# Altium schematic sheet lte-router_V2.SchDoc
size A2
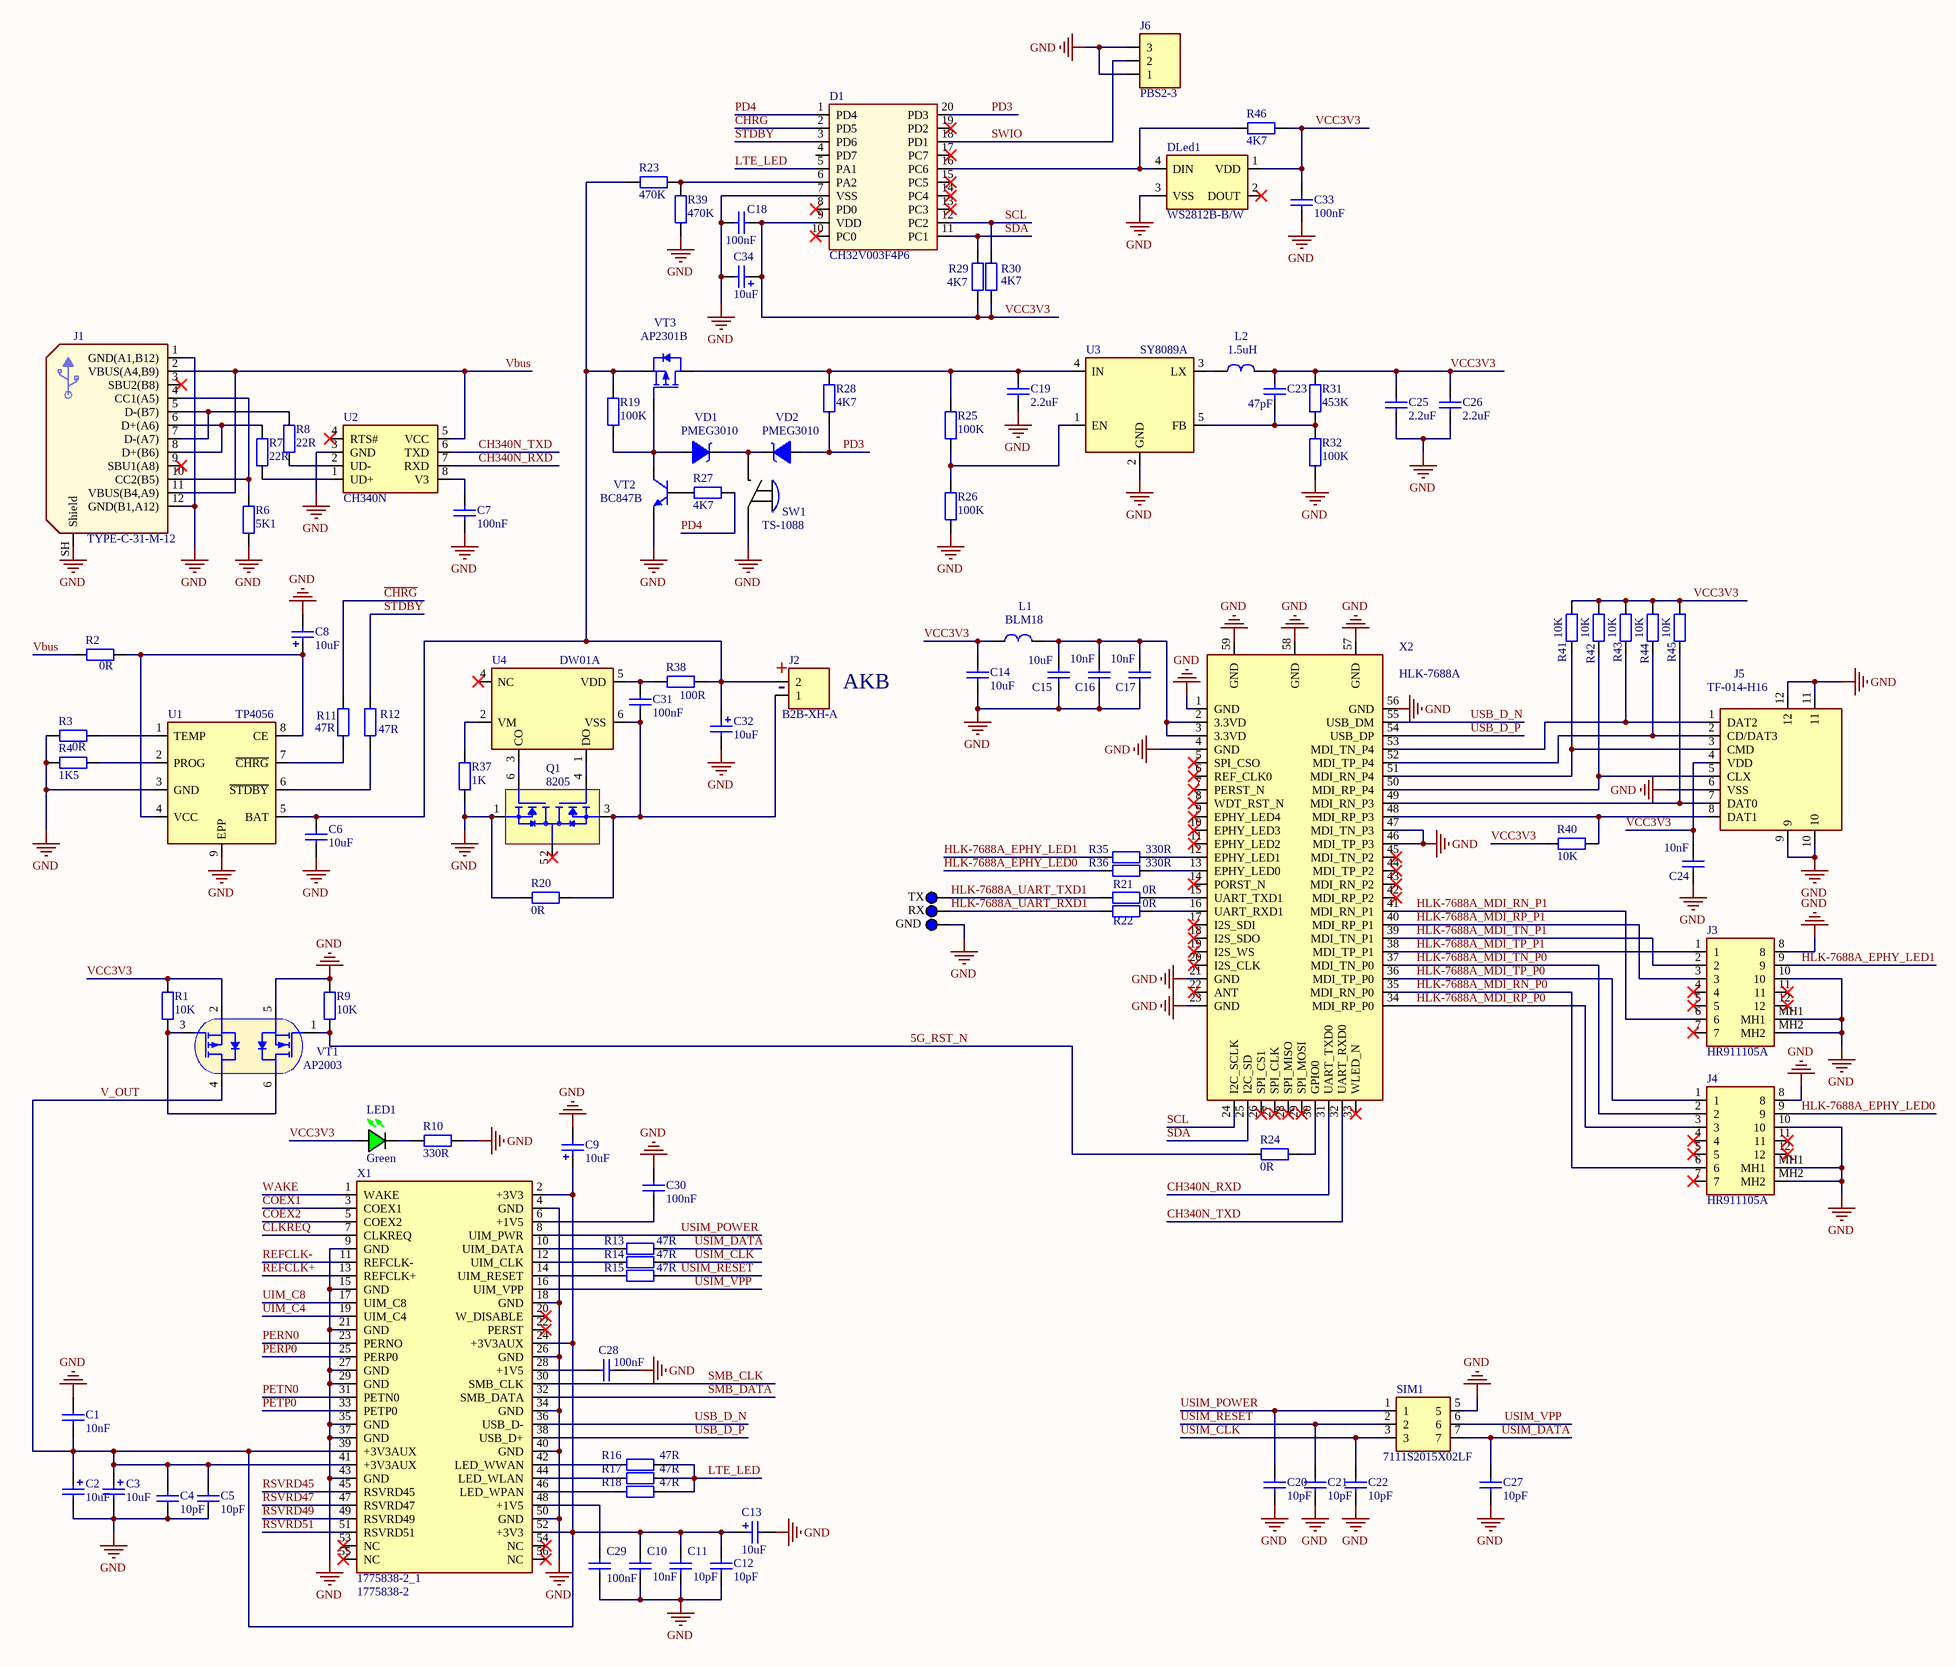
[diagram p0: lte-router_V2.SchDoc]

## Parts
C1  value 10nF  [C_0402]  (hidden comment: Cap1)
C2  value 10uF  [TANT_CAP_A]  (hidden comment: CapPOL1)
C3  value 10uF  [TANT_CAP_A]  (hidden comment: CapPOL1)
C4  value 10pF  [C_0402]  (hidden comment: Cap1)
C5  value 10pF  [C_0402]  (hidden comment: Cap1)
C6  value 10uF  [C_0805]  (hidden comment: Cap1)
C7  value 100nF  [C_0402]  (hidden comment: Cap1)
C8  value 10uF  [TANT_CAP_A]  (hidden comment: CapPOL1)
C9  value 10uF  [TANT_CAP_A]  (hidden comment: CapPOL1)
C10  value 10nF  [C_0402]  (hidden comment: Cap1)
C11  value 10pF  [C_0402]  (hidden comment: Cap1)
C12  value 10pF  [C_0402]  (hidden comment: Cap1)
C13  value 10uF  [TANT_CAP_A]  (hidden comment: CapPOL1)
C14  value 10uF  [C_0402]  (hidden comment: Cap1)
C15  value 10uF  [C_0402]  (hidden comment: Cap1)
C16  value 10nF  [C_0402]  (hidden comment: Cap1)
C17  value 10nF  [C_0402]  (hidden comment: Cap1)
C18  value 100nF  [C_0402]  (hidden comment: Cap1)
C19  value 2.2uF  [C_0603]  (hidden comment: Cap1)
C20  value 10pF  [C_0402]  (hidden comment: Cap1)
C21  value 10pF  [C_0402]  (hidden comment: Cap1)
C22  value 10pF  [C_0402]  (hidden comment: Cap1)
C23  value 47pF  [C_0402]  (hidden comment: Cap1)
C24  value 10nF  [C_0402]  (hidden comment: Cap1)
C25  value 2.2uF  [C_0603]  (hidden comment: Cap1)
C26  value 2.2uF  [C_0603]  (hidden comment: Cap1)
C27  value 10pF  [C_0402]  (hidden comment: Cap1)
C28  value 100nF  [C_0402]  (hidden comment: Cap1)
C29  value 100nF  [C_0402]  (hidden comment: Cap1)
C30  value 100nF  [C_0402]  (hidden comment: Cap1)
C31  value 100nF  [C_0402]  (hidden comment: Cap1)
C32  value 10uF  [TANT_CAP_A]  (hidden comment: CapPOL1)
C33  value 100nF  [C_0402]  (hidden comment: Cap1)
C34  value 10uF  [TANT_CAP_A]  (hidden comment: CapPOL1)
D1  value CH32V003F4P6  [TSSOP20]  (hidden comment: CH32V003F4P6_1)
DLed1  value WS2812B-B/W  [SMD5050]  (hidden comment: D_RGB_LED1)
GND  GND  [KP_c2_h1]  (value not drawn)
J1  value TYPE-C-31-M-12  [USB-31CW04-01(R)N]  (hidden comment: USB-TYPE-C-12pin_1)
J2  value B2B-XH-A  [B2B-XH-A]  (hidden comment: Conn2)
J3  value HR911105A  [HR911105A]  (hidden comment: HR911105A_1)
J4  value HR911105A  [HR911105A]  (hidden comment: HR911105A_1)
J5  value TF-014-H16  [TF-014-H16]  (hidden comment: SD-CARD-12pin_1)
J6  value PBS2-3  [PBS2-3]  (hidden comment: Conn3)
L1  value BLM18  [L_0603]  (hidden comment: Inductor1)
L2  value 1.5uH  [SMD4x4]  (hidden comment: Inductor1)
LED1  value Green  [LED_0402_G]  (hidden comment: LED_G1)
Q1  value 8205  [SOT-23-6]  (hidden comment: FS8205A_1)
R1  value 10K  [R_0402]  (hidden comment: Res1)
R2  value 0R  [R_0402]  (hidden comment: Res1)
R3  value 0R  [R_0402]  (hidden comment: Res1)
R4  value 1K5  [R_0402]  (hidden comment: Res1)
R6  value 5K1  [R_0402]  (hidden comment: Res1)
R7  value 22R  [R_0402]  (hidden comment: Res1)
R8  value 22R  [R_0402]  (hidden comment: Res1)
R9  value 10K  [R_0402]  (hidden comment: Res1)
R10  value 330R  [R_0402]  (hidden comment: Res1)
R11  value 47R  [R_0402]  (hidden comment: Res1)
R12  value 47R  [R_0402]  (hidden comment: Res1)
R13  value 47R  [R_0402]  (hidden comment: Res1)
R14  value 47R  [R_0402]  (hidden comment: Res1)
R15  value 47R  [R_0402]  (hidden comment: Res1)
R16  value 47R  [R_0402]  (hidden comment: Res1)
R17  value 47R  [R_0402]  (hidden comment: Res1)
R18  value 47R  [R_0402]  (hidden comment: Res1)
R19  value 100K  [R_0402]  (hidden comment: Res1)
R20  value 0R  [R_0603]  (hidden comment: Res1)
R21  value 0R  [R_0402]  (hidden comment: Res1)
R22  value 0R  [R_0402]  (hidden comment: Res1)
R23  value 470K  [R_0402]  (hidden comment: Res1)
R24  value 0R  [R_0402]  (hidden comment: Res1)
R25  value 100K  [R_0402]  (hidden comment: Res1)
R26  value 100K  [R_0402]  (hidden comment: Res1)
R27  value 4K7  [R_0402]  (hidden comment: Res1)
R28  value 4K7  [R_0402]  (hidden comment: Res1)
R29  value 4K7  [R_0402]  (hidden comment: Res1)
R30  value 4K7  [R_0402]  (hidden comment: Res1)
R31  value 453K  [R_0402]  (hidden comment: Res1)
R32  value 100K  [R_0402]  (hidden comment: Res1)
R35  value 330R  [R_0402]  (hidden comment: Res1)
R36  value 330R  [R_0402]  (hidden comment: Res1)
R37  value 1K  [R_0402]  (hidden comment: Res1)
R38  value 100R  [R_0402]  (hidden comment: Res1)
R39  value 470K  [R_0402]  (hidden comment: Res1)
R40  value 10K  [R_0402]  (hidden comment: Res1)
R41  value 10K  [R_0402]  (hidden comment: Res1)
R42  value 10K  [R_0402]  (hidden comment: Res1)
R43  value 10K  [R_0402]  (hidden comment: Res1)
R44  value 10K  [R_0402]  (hidden comment: Res1)
R45  value 10K  [R_0402]  (hidden comment: Res1)
R46  value 4K7  [R_0402]  (hidden comment: Res1)
RX  RX  [KP_c2_h1]  (value not drawn)
SIM1  7111S2015X02LF  [7111S2015X02LF]
SW1  value TS-1088  [TS1088AR02016]  (hidden comment: SW1)
TX  TX  [KP_c2_h1]  (value not drawn)
U1  value TP4056  [ESOP-8]  (hidden comment: TP4056_1)
U2  value CH340N  [SOP-8]  (hidden comment: CH340N_1)
U3  value SY8089A  [SOT-23-5]  (hidden comment: SY8089_1)
U4  value DW01A  [SOT-23-6]  (hidden comment: DW01A_2)
VD1  value PMEG3010  [SOD123]  (hidden comment: D_Shottky1)
VD2  value PMEG3010  [SOD123]  (hidden comment: D_Shottky1)
VT1  value AP2003  [SOT-23-6L]  (hidden comment: P-CH_N-CH)
VT2  value BC847B  [SOT-23-3]  (hidden comment: NPN1)
VT3  value AP2301B  [SOT-23-3]  (hidden comment: P-CH_1)
X1  1775838-2_1  value 1775838-2  [17758382]
X2  value HLK-7688A  [7688A]  (hidden comment: HLK-7688A_1)

## Nets
GND: C1.2 C2.2 C3.2 C4.1 C5.1 C6.2 C7.2 C8.2 C9.2 C10.1 C11.1 C12.1 C13.2 C14.1 C15.1 C16.1 C17.1 C18.2 C19.1 C20.1 C21.1 C22.1 C24.1 C25.1 C26.1 C27.1 C28.1 C29.2 C30.2 C32.2 C33.1 C34.2 D1.7(VSS) DLed1.3(VSS) GND.1 J1.1(GND(A1,B12)) J1.12(GND(B1,A12)) J1.SH(Shield) J3.8 J3.10 J3.MH1 J3.MH2 J4.8 J4.10 J4.MH1 J4.MH2 J5.6(VSS) J5.9 J5.10 J5.11 J5.12 J6.1 J6.3 Q1.1(S1) R3.1 R4.1 R6.1 R9.2 R10.2 R20.1 R26.1 R32.1 R37.1 R39.1 SIM1.5 SW1.1 U1.3(GND) U1.9(EPP) U2.3(GND) U3.2(GND) VT1.5(S1) VT2.2(E) X1.4(GND) X1.9(GND) X1.15(GND) X1.18(GND) X1.21(GND) X1.26(GND) X1.27(GND) X1.29(GND) X1.34(GND) X1.35(GND) X1.37(GND) X1.40(GND) X1.43(GND) X1.50(GND) X2.1(GND) X2.4(GND) X2.21(GND) X2.23(GND) X2.46(MDI_TP_P3) X2.47(MDI_TN_P3) X2.56(GND) X2.57(GND) X2.58(GND) X2.59(GND)
5G_RST_N: R9.1 R24.1 VT1.1(G1)
~{CHRG}: D1.2(PD5) R11.2
~{CLKREQ}: X1.7(CLKREQ)
CH340N_RXD: U2.7(RXD) X2.31(UART_TXD0)
CH340N_TXD: U2.6(TXD) X2.32(UART_RXD0)
COEX1: X1.3(COEX1)
COEX2: X1.5(COEX2)
HLK-7688A_EPHY_LED0: J4.9 R36.1
HLK-7688A_EPHY_LED1: J3.9 R35.1
HLK-7688A_MDI_RN_P0: J4.6 X2.35(MDI_RN_P0)
HLK-7688A_MDI_RN_P1: J3.6 X2.41(MDI_RN_P1)
HLK-7688A_MDI_RP_P0: J4.3 X2.34(MDI_RP_P0)
HLK-7688A_MDI_RP_P1: J3.3 X2.40(MDI_RP_P1)
HLK-7688A_MDI_TN_P0: J4.2 X2.37(MDI_TN_P0)
HLK-7688A_MDI_TN_P1: J3.2 X2.39(MDI_TN_P1)
HLK-7688A_MDI_TP_P0: J4.1 X2.36(MDI_TP_P0)
HLK-7688A_MDI_TP_P1: J3.1 X2.38(MDI_TP_P1)
HLK-7688A_UART_RXD1: R22.1 RX.1
HLK-7688A_UART_TXD1: R21.1 TX.1
LTE_LED: D1.5(PA1) R16.2 R17.2 R18.2
PD3: D1.20(PD3) R28.1 VD2.2
PD4: D1.1(PD4) R27.2
PERN0: X1.23(PERNO)
PERP0: X1.25(PERP0)
PETN0: X1.31(PETN0)
PETP0: X1.33(PETP0)
REFCLK+: X1.13(REFCLK+)
REFCLK-: X1.11(REFCLK-)
RSVRD45: X1.45(RSVRD45)
RSVRD47: X1.47(RSVRD47)
RSVRD49: X1.49(RSVRD49)
RSVRD51: X1.51(RSVRD51)
~{STDBY}: D1.3(PD6) R12.2
SCL: D1.12(PC2) R30.2 X2.24(I2C_SCLK)
SDA: D1.11(PC1) R29.2 X2.25(I2C_SD)
SMB_CLK: X1.30(SMB_CLK)
SMB_DATA: X1.32(SMB_DATA)
SWIO: D1.18(PD1) J6.2
UIM_C4: X1.19(UIM_C4)
UIM_C8: X1.17(UIM_C8)
USB_D_N: X1.36(USB_D-) X2.55(USB_DM)
USB_D_P: X1.38(USB_D+) X2.54(USB_DP)
USIM_CLK: C22.2 R14.2 SIM1.3
USIM_DATA: C27.2 R13.2 SIM1.7
USIM_POWER: C20.2 SIM1.1 X1.8(UIM_PWR)
USIM_RESET: C21.2 R15.2 SIM1.2
USIM_VPP: SIM1.6 X1.16(UIM_VPP)
V_OUT: C1.1 C2.1 C3.1 C4.2 C5.2 C9.1 C10.2 C11.2 C12.2 C13.1 VT1.4(D2) X1.2(+3V3) X1.24(+3V3AUX) X1.39(+3V3AUX) X1.41(+3V3AUX) X1.52(+3V3)
Vbus: J1.2(VBUS(A4,B9)) J1.11(VBUS(B4,A9)) R2.1 U2.5(VCC)
VCC3V3: C14.2 C18.1 C23.2 C24.2 C25.2 C26.2 C33.2 C34.1 D1.9(VDD) DLed1.1(VDD) J5.4(VDD) L1.1 L2.2 LED1.2(A) R1.2 R29.1 R30.1 R31.2 R40.2 R41.2 R42.2 R43.2 R44.2 R45.2 R46.2 VT1.2(S2)
WAKE: X1.1(WAKE)
NetC6_1: C6.1 C32.1 J2.2 R19.2 R23.2 R38.2 U1.5(BAT) VT3.2(S)
NetC7_1: C7.1 U2.8(V3)
NetC8_1: C8.1 R2.2 U1.4(VCC) U1.8(CE)
NetC15_2: C15.2 C16.2 C17.2 L1.2 X2.2(3.3VD) X2.3(3.3VD)
NetC19_2: C19.2 R25.2 R28.2 U3.4(IN) VT3.3(D)
NetC23_1: C23.1 R31.1 R32.2 U3.5(FB)
NetC28_2: C28.2 X1.28(+1V5)
NetC29_1: C29.1 X1.48(+1V5)
NetC30_1: C30.1 X1.6(+1V5)
NetC31_1: C31.1 J2.1 Q1.3(S2) R20.2 U4.6(VSS)
NetC31_2: C31.2 R38.1 U4.5(VDD)
NetD1_6: D1.6(PA2) R23.1 R39.2
NetD1_16: D1.16(PC6) DLed1.4(DIN) R46.1
NetJ1_4: J1.4(CC1(A5)) J1.10(CC2(B5)) R6.2
NetJ1_5: J1.5(D-(B7)) J1.7(D-(A7)) R8.2
NetJ1_6: J1.6(D+(A6)) J1.8(D+(B6)) R7.2
NetJ5_1: J5.1(DAT2) R43.1 X2.53(MDI_TN_P4)
NetJ5_2: J5.2(CD/DAT3) R44.1 X2.52(MDI_TP_P4)
NetJ5_3: J5.3(CMD) R41.1 X2.51(MDI_RN_P4)
NetJ5_5: J5.5(CLX) R42.1 X2.50(MDI_RP_P4)
NetJ5_7: J5.7(DAT0) R45.1 X2.49(MDI_RN_P3)
NetJ5_8: J5.8(DAT1) R40.1 X2.48(MDI_RP_P3)
NetL2_1: L2.1 U3.3(LX)
NetLED1_1: LED1.1(K) R10.1
NetQ1_2: Q1.2(D1) Q1.5(D2)
NetQ1_4: Q1.4(G2) U4.1(DO)
NetQ1_6: Q1.6(G1) U4.3(CO)
NetR1_1: R1.1 VT1.3(G2) VT1.6(D1)
NetR3_2: R3.2 U1.1(TEMP)
NetR4_2: R4.2 U1.2(PROG)
NetR7_1: R7.1 U2.1(UD+)
NetR8_1: R8.1 U2.2(UD-)
NetR11_1: R11.1 U1.7(~{CHRG})
NetR12_1: R12.1 U1.6(~{STDBY})
NetR13_1: R13.1 X1.10(UIM_DATA)
NetR14_1: R14.1 X1.12(UIM_CLK)
NetR15_1: R15.1 X1.14(UIM_RESET)
NetR16_1: R16.1 X1.42(LED_WWAN)
NetR17_1: R17.1 X1.44(LED_WLAN)
NetR18_1: R18.1 X1.46(LED_WPAN)
NetR19_1: R19.1 VD1.2 VT2.3(C) VT3.1(G)
NetR21_2: R21.2 X2.15(UART_TXD1)
NetR22_2: R22.2 X2.16(UART_RXD1)
NetR24_2: R24.2 X2.30(GPIO0)
NetR25_1: R25.1 R26.2 U3.1(EN)
NetR27_1: R27.1 VT2.1(B)
NetR35_2: R35.2 X2.12(EPHY_LED1)
NetR36_2: R36.2 X2.13(EPHY_LED0)
NetR37_2: R37.2 U4.2(VM)
NetSW1_2: SW1.2 VD1.1 VD2.1

Not connected (* = marked no-connect by the designer): D1 4(PD7) 8(PD0)* 10(PC0)* 13(PC3)* 14(PC4)* 15(PC5)* 17(PC7)* 19(PD2)*; DLed1 2(DOUT)*; J1 3(SBU2(B8))* 9(SBU1(A8))*; J3 4* 5* 7* 11* 12*; J4 4* 5* 7* 11* 12*; U2 4(RTS#)*; U4 4(NC)*; X1 20(W_DISABLE)* 22(PERST)* 53(NC)* 54(NC)* 55(NC)* 56(NC)*; X2 5(SPI_CSO)* 6(REF_CLK0)* 7(PERST_N)* 8(WDT_RST_N)* 9(EPHY_LED4)* 10(EPHY_LED3)* 11(EPHY_LED2)* 14(PORST_N)* 17(I2S_SDI)* 18(I2S_SDO)* 19(I2S_WS)* 20(I2S_CLK)* 22(ANT)* 26(SPI_CS1)* 27(SPI_CLK)* 28(SPI_MISO)* 29(SPI_MOSI)* 33(WLED_N)* 42(MDI_RP_P2)* 43(MDI_RN_P2)* 44(MDI_TP_P2)* 45(MDI_TN_P2)*

## Notes on the sheet
- (near J2) +
- (near J2) -
- AKB

## Library data of the parts
C1 C10 C16 C17 C24 = Cap_14: CAP CER 10nF ±10% 50V X7R 0402; Manufacturer: Samsung Electro-Mechanics; Part Number: CAP 0402 X7R 10nF 50V; Manufacturer Part Number: CL05B103KB5NNNC; Item: Cap_14; Type: SMD; Date Of Revision: 22-Nov-24; Operating Temperature: -55°C ~ 125°C; Packaging: Cut Tape (CT); Supplier Unit Price 1: 0.08; Supplier Unit Price 100: 0.004; Supplier 1: DiGiKey; Supplier Part Number 1: 1276-1028-1-ND; Supplier 2: JLCPCB; Supplier Part Number 2: C15195; Supplier 3: Kosmodrom; Supplier Part Number 3: 00-00073522
C2 C3 C8 C9 C13 C32 C34 = Cap_50: CAP TANT 10UF 20% 10V 1206; Manufacturer: KYOCERA AVX; Part Number: CAP TANT 10mkF 10V "A"; Manufacturer Part Number: TAJA106M010RNJ; Item: Cap_50; Type: SMD; Date Of Revision: 05-Dec-24; Operating Temperature: -55°C ~ 125°C; Packaging: Cut Tape (CT); Supplier Unit Price 1: 0.37; Supplier Unit Price 100: 0.1386; Supplier 1: DiGiKey; Supplier Part Number 1: 478-1657-1-ND; Supplier 2: JLCPCB; Supplier Part Number 2: C92127; Supplier 3: IMRAD; Supplier Part Number 3: 369662
C4 C5 C11 C12 C20-C22 C27 = Cap_1: CAP CER 10PF ±5% 50V C0G/NP0 0402; Manufacturer: Murata Electronics; Part Number: CAP 0402 NP0 10pF 50V; Manufacturer Part Number: GRM1555C1H100JA01D; Item: Cap_1; Type: SMD; Date Of Revision: 22-Nov-24; Operating Temperature: -55°C ~ 125°C; Packaging: Cut Tape (CT); Supplier Unit Price 1: 0.08; Supplier Unit Price 100: 0.0072; Supplier 1: DiGiKey; Supplier Part Number 1: 490-5921-1-ND; Supplier 2: JLCPCB; Supplier Part Number 2: C76946; Supplier 3: Kosmodrom; Supplier Part Number 3: 00-00034318
C6 = Cap_41: CAP CER 10UF ±10% 16V X7R 0805; Manufacturer: Samsung Electro-Mechanics; Part Number: CAP 0805 X7R 10mkF 16V; Manufacturer Part Number: CL21B106KOQNNNE; Item: Cap_41; Type: SMD; Date Of Revision: 01-Aug-24; Operating Temperature: -55°C ~ 125°C; Packaging: Cut Tape (CT); Supplier Unit Price 1: 0.26; Supplier Unit Price 100: 0.0841; Supplier 1: DiGiKey; Supplier Part Number 1: 1276-2872-1-ND; Supplier 2: JLCPCB; Supplier Part Number 2: C95841; Supplier 3: Kosmodrom; Supplier Part Number 3: 00-00073508
C7 C28-C31 = Cap_18: CAP CER 0.1UF ±10% 50V X7R 0402; Manufacturer: Murata Electronics; Part Number: CAP 0402 X7R 100nF 50V; Manufacturer Part Number: GRM155R71H104KE14J; Item: Cap_18; Type: SMD; Date Of Revision: 24-Nov-24; Operating Temperature: -55°C ~ 125°C; Packaging: Cut Tape (CT); Supplier Unit Price 1: 0.08; Supplier Unit Price 100: 0.0072; Supplier 1: DiGiKey; Supplier Part Number 1: 490-13342-1-ND; Supplier 2: JLCPCB; Supplier Part Number 2: C2649519; Supplier 3: Kosmodrom; Supplier Part Number 3: 00-00069281
C14 C15 = Cap_28: CAP CER 10UF ±10% 10V X6S 0603; Manufacturer: Murata Electronics; Part Number: CAP 0603 X6S 10mkF 10V; Manufacturer Part Number: GRM188C81A106KA73D; Item: Cap_28; Type: SMD; Date Of Revision: 22-Nov-24; Operating Temperature: -55°C ~ 105°C; Packaging: Cut Tape (CT); Supplier Unit Price 1: 0.26; Supplier Unit Price 100: 0.0933; Supplier 1: DiGiKey; Supplier Part Number 1: 490-GRM188C81A106KA73DCT-ND; Supplier 2: JLCPCB; Supplier Part Number 2: C385036; Supplier 3: Kosmodrom; Supplier Part Number 3: 00-00073533
C18 C33 = Cap_24: CAP CER 0.1UF ±10% 50V X7R 0402; Manufacturer: Murata Electronics; Part Number: CAP 0402 X7R 100nF 50V; Manufacturer Part Number: GRM155R71H104KE14J; Item: Cap_24; Type: SMD; Date Of Revision: 24-Nov-24; Operating Temperature: -55°C ~ 125°C; Packaging: Cut Tape (CT); Supplier Unit Price 1: 0.08; Supplier Unit Price 100: 0.0072; Supplier 1: DiGiKey; Supplier Part Number 1: 490-13342-1-ND; Supplier 2: JLCPCB; Supplier Part Number 2: C2649519; Supplier 3: Kosmodrom; Supplier Part Number 3: 00-00069281
C19 C25 C26 = Cap_27: CAP CER 2.2UF ±10% 10V X7R 0603; Manufacturer: Samsung Electro-Mechanics; Part Number: CAP 0603 X7R 2.2mkF 10V; Manufacturer Part Number: CL10B225KP8NNNC; Item: Cap_27; Type: SMD; Date Of Revision: 19-May-24; Operating Temperature: -55°C ~ 125°C; Packaging: Cut Tape (CT); Supplier Unit Price 1: 0.1; Supplier Unit Price 100: 0.0329; Supplier 1: DiGiKey; Supplier Part Number 1: 1276-1134-1-ND; Supplier 2: JLCPCB; Supplier Part Number 2: C100082; Supplier 3: Kosmodrom; Supplier Part Number 3: 00-00034462
C23 = Cap_5: CAP CER 47PF ±5%  50V C0G/NP0 0402; Manufacturer: Samsung Electro-Mechanics; Part Number: CAP 0402 C0G/NP0 47pF 50V; Manufacturer Part Number: CL05C470JB5NNNC; Item: Cap_5; Type: SMD; Date Of Revision: 22-Nov-24; Operating Temperature: -55°C ~ 125°C; Packaging: Cut Tape (CT); Supplier Unit Price 1: 0.1; Supplier Unit Price 100: 0.0086; Supplier 1: DiGiKey; Supplier Part Number 1: 1276-1699-1-ND; Supplier 2: JLCPCB; Supplier Part Number 2: C84706; Supplier 3: Kosmodrom; Supplier Part Number 3: 00-00034330
D1 = Chip_18: TSSOP-20-175mil  Microcontrollers (MCU/MPU/SOC) ROHS; Manufacturer: WCH(Jiangsu Qin Heng); Part Number: Analog STM8S003; Type: SMD; Item: Chip_18; Date Of Revision: 14-Jan-25; Manufacturer Part Number: CH32V003F4P6; Operating Temperature: -40°C ~ 85°C; Supplier 1: DiGiKey; Supplier 2: JLCPCB; Supplier Part Number 2: CH32V003F4P6; Supplier 3: Kosmodrom; Supplier Part Number 3: 00-
DLed1 = Led_4: SMD5050 RGB LEDs(Built-in IC) ROHS; Manufacturer: Worldsemi; Part Number: SMD5050 RGB LED 5x5mm; Item: Led_4; Date Of Revision: 14-Jan-25; Manufacturer Part Number: WS2812B-B/W; Supplier 1: DiGiKey; Supplier 2: JLCPCB; Supplier Part Number 2: C114586; Supplier 3: Kosmodrom; Supplier Part Number 3: 00-; Type: SMD
GND RX TX = WC_1: Kontrol Point c2.0mm_h1.0mm; Value: KP_c2_h1; Item: WC_1; Date Of Revision: 02-May-24; Part Number: KP_c2_h1; Manufacturer Part Number: KP_c2_h1; Supplier 1: DiGiKey; Supplier 2: JLCPCB; Supplier 3: Kosmodrom; Supplier Part Number 3: 00-; Type: Thru-hole
J1 = Conn_38: 5A 1 16P Female Type-C SMD USB Connectors ROHS; Manufacturer: Korean Hroparts Elec; Part Number: Conneector USB-Type C 12pin; Item: Conn_38; Date Of Revision: 22-Nov-24; Manufacturer Part Number: TYPE-C-31-M-12; Operating Temperature: -30°C ~ 80°C; Packaging: Cut Tape (CT); Supplier 1: DiGiKey; Supplier 2: JLCPCB; Supplier Part Number 2: C165948; Supplier 3: IMRAD; Supplier Part Number 3: 440808; Type: Thru-hole
J2 = Conn_21: CONN HEADER VERT 2POS 2.5MM; Manufacturer: JST Sales America Inc.; Item: Conn_21; Date Of Revision: 30-Jan-24; Part Number: B2B-XH-A; Manufacturer Part Number: B2B-XH-A; Operating Temperature: -25°C ~ 85°C; Supplier Unit Price 1: 0.14; Supplier Unit Price 100: 0.0822; Supplier 1: DiGiKey; Supplier Part Number 1: 455-B2B-XH-A-ND; Supplier 2: JLCPCB; Supplier Part Number 2: C158012; Supplier 3: IMRAD; Supplier Part Number 3: 407435; Type: Thru-hole
J3 J4 = Conn_39: RJ45Receptacle 1 WithLED Plugin Ethernet Connectors / Modular Connectors (RJ45 RJ11) ROHS; Manufacturer: HANRUN(Zhongshan HanRun Elec); Part Number: RJ-45 Connector with LED; Item: Conn_39; Date Of Revision: 16-Nov-24; Manufacturer Part Number: HR911105A; Operating Temperature: -0°C ~ 70°C; Packaging: Cut Tape (CT); Supplier 1: DiGiKey; Supplier 2: JLCPCB; Supplier Part Number 2: C12074; Supplier 3: Kosmodrom; Supplier Part Number 3: 00-00040411; Type: Thru-hole
J5 = Conn_40: -20℃~+85℃ 1.6mm Gold Card Slot MicroSD card (TF card) Flip type SMD  SD Card / Memory Card Connector ROHS; Manufacturer: Hanbo Electronic; Part Number: SD-CARD HOLDER; Item: Conn_40; Date Of Revision: 16-Nov-24; Manufacturer Part Number: TF-014-H16; Operating Temperature: -20°C ~ 85°C; Packaging: Cut Tape (CT); Supplier 1: DiGiKey; Supplier 2: JLCPCB; Supplier Part Number 2: C2874208; Supplier 3: Kosmodrom; Supplier Part Number 3: 00-; Type: SMD
J6 = Conn_21: CONNECTOR FOR FLASH PBS3-2mm; Manufacturer: CONNFLY; Item: Conn_21; Date Of Revision: 02-Jan-25; Part Number: PBS2-3; Manufacturer Part Number: PBS2-3; Supplier 1: DiGiKey; Supplier 2: JLCPCB; Supplier 3: Kosmodrom; Supplier Part Number 3: 00-00040706; Type: Thru-hole
L1 = Coil_2: FERRITE BEAD 220 OHM 0603 1LN; Manufacturer: Murata Electronics; Manufacturer Part Number: BLM18EG221TN1D; Item: Coil_2; Type: SMD; Date Of Revision: 16-Nov-24; Part Number: FERRITE BEAD 220 OHM; Operating Temperature: -55°C ~ 125°C; Packaging: Cut Tape (CT); Supplier Unit Price 1: 0.24; Supplier Unit Price 100: 0.1161; Supplier 1: DiGiKey; Supplier Part Number 1: 490-5979-1-ND; Supplier 2: JLCPCB; Supplier Part Number 2: C113025; Supplier 3: IMRAD; Supplier Part Number 3: 245775
L2 = Coil_13: 3.6A 1.5uH ±20% 5.3A SMD,4x4mm Power Inductors ROHS; Manufacturer: cjiang (Changjiang Microelectronics Tech); Part Number: INDUCTOR 1.5uH 3.6A; Manufacturer Part Number: FNR4030S1R5MT; Item: Coil_13; Date Of Revision: 17-Nov-24; Operating Temperature: -40°C ~ 125°C; Supplier 1: DiGiKey; Supplier 2: JLCPCB; Supplier Part Number 2: C167867; Supplier 3: Kosmodrom; Supplier Part Number 3: 00-; Type: SMD
LED1 = Led_7: LED GREEN CLEAR 2SMD; Manufacturer: Kingbright; Part Number: LED GREEN  SMD0402; Manufacturer Part Number: APHHS1005LCGCK; Item: Led_7; Type: SMD; Date Of Revision: 22-Nov-24; Operating Temperature: -40°C ~ 85°C; Packaging: Cut Tape (CT); Supplier Unit Price 1: 0.41; Supplier Unit Price 100: 0.1473; Supplier 1: DiGiKey; Supplier Part Number 1: 754-2121-1-ND; Supplier 2: JLCPCB; Supplier Part Number 2: C2852592; Supplier 3: Kosmodrom; Supplier Part Number 3: 00-00061954
Q1 = Chip_14: 20V 6A 19mΩ 1.2V 1 N-Channel SOT-23-6 MOSFETs ROHS; Manufacturer: HL; Type: SMD; Item: Chip_14; Date Of Revision: 05-Dec-24; Part Number: 8205; Manufacturer Part Number: 8205; Operating Temperature: -55°C ~ 150°C; Supplier 1: DiGiKey; Supplier 2: JLCPCB; Supplier Part Number 2: C7499847; Supplier 3: Kosmodrom; Supplier Part Number 3: 00-
R1 R9 = Res_57: RES 10K OHM 1% 1/16W 0402; Manufacturer: YAGEO; Part Number: RES 0402 10K 1%; Manufacturer Part Number: RC0402FR-0710KL; Item: Res_57; Date Of Revision: 22-Nov-24; Operating Temperature: -55°C ~ 155°C; Packaging: Cut Tape (CT); Supplier Unit Price 1: 0.1; Supplier Unit Price 100: 0.0051; Supplier 1: DiGiKey; Supplier Part Number 1: 311-10.0KLRCT-ND; Supplier 2: JLCPCB; Supplier Part Number 2: C60490; Supplier 3: Kosmodrom; Supplier Part Number 3: 00-00071557; Type: SMD
R2 R3 R21 R22 R24 = Res_6: RES 0 OHM JUMPER 1/16W 0402; Manufacturer: YAGEO; Part Number: RES 0402 0R; Manufacturer Part Number: RC0402JR-070RL; Item: Res_6; Date Of Revision: 22-Nov-24; Operating Temperature: -55°C ~ 155°C; Packaging: Cut Tape (CT); Supplier Unit Price 1: 0.1; Supplier Unit Price 100: 0.002; Supplier 1: DiGiKey; Supplier Part Number 1: 311-0.0JRCT-ND; Supplier 2: JLCPCB; Supplier Part Number 2: C60485; Supplier 3: Kosmodrom; Supplier Part Number 3: 00-00033680; Type: SMD
R4 = Res_42: RES 1.5K OHM 1% 1/16W 0402; Manufacturer: Walsin Technology Corporation; Part Number: RES 0402 1K5 1%; Manufacturer Part Number: WR04X1501FTL; Item: Res_42; Date Of Revision: 24-Nov-24; Operating Temperature: -55°C ~ 155°C; Packaging: Cut Tape (CT); Supplier Unit Price 1: 0.1; Supplier Unit Price 100: 0.0041; Supplier 1: DiGiKey; Supplier Part Number 1: 1292-WR04X1501FTLCT-ND; Supplier 2: JLCPCB; Supplier Part Number 2: C163805; Supplier 3: IMRAD; Supplier Part Number 3: 463005; Type: SMD
R6 = Res_53: RES 5.1K OHM 1% 1/10W 0402; Manufacturer: KOA Speer Electronics, Inc.; Part Number: RES 0402 5K1 1%; Manufacturer Part Number: RK73H1ETTP5101F; Item: Res_53; Date Of Revision: 24-Nov-24; Operating Temperature: -55°C ~ 155°C; Packaging: Cut Tape (CT); Supplier Unit Price 1: 0.1; Supplier Unit Price 100: 0.0122; Supplier 1: DiGiKey; Supplier Part Number 1: 2019-RK73H1ETTP5101FCT-ND; Supplier 2: JLCPCB; Supplier Part Number 2: C159990; Supplier 3: IMRAD; Supplier Part Number 3: 407317; Type: SMD
R7 R8 = Res_18: RES 22 OHM 1% 1/16W 0402; Manufacturer: Walsin Technology Corporation; Part Number: RES 0402 22R 1%; Manufacturer Part Number: WR04X22R0FTL; Item: Res_18; Date Of Revision: 24-Nov-24; Operating Temperature: -55°C ~ 155°C; Packaging: Cut Tape (CT); Supplier Unit Price 1: 0.1; Supplier Unit Price 100: 0.004; Supplier 1: DiGiKey; Supplier Part Number 1: 1292-WR04X22R0FTLTR-ND; Supplier 2: JLCPCB; Supplier Part Number 2: C163821; Supplier 3: Kosmodrom; Supplier Part Number 3: 00-00033706; Type: SMD
R10 R35 = Res_30: RES 330 OHM 5% 1/16W 0402; Manufacturer: Walsin Technology Corporation; Part Number: RES 0402 330R 5%; Manufacturer Part Number: WR04X331 JTL; Item: Res_30; Date Of Revision: 22-Nov-24; Operating Temperature: -55°C ~ 155°C; Packaging: Cut Tape (CT); Supplier Unit Price 1: 0.1; Supplier Unit Price 100: 0.0041; Supplier 1: DiGiKey; Supplier Part Number 1: 1292-WR04X331JTLCT-ND; Supplier 2: JLCPCB; Supplier Part Number 2: C168264; Supplier 3: Kosmodrom; Supplier Part Number 3: 00-00033727; Type: SMD
R11 R12 R16-R18 = Res_25: RES 47 OHM 5% 1/16W 0402; Manufacturer: Walsin Technology Corporation; Part Number: RES 0402 47R 5%; Manufacturer Part Number: WR04X470 JTL; Item: Res_25; Date Of Revision: 22-Nov-24; Operating Temperature: -55°C ~ 155°C; Packaging: Cut Tape (CT); Supplier Unit Price 1: 0.1; Supplier Unit Price 100: 0.0041; Supplier 1: DiGiKey; Supplier Part Number 1: 1292-WR04X470JTLCT-ND; Supplier 2: JLCPCB; Supplier Part Number 2: C170414; Supplier 3: Kosmodrom; Supplier Part Number 3: 00-00033711; Type: SMD
R13-R15 = Res_21: RES 47 OHM 5% 1/16W 0402; Manufacturer: Walsin Technology Corporation; Part Number: RES 0402 47R 5%; Manufacturer Part Number: WR04X470 JTL; Item: Res_21; Date Of Revision: 22-Nov-24; Operating Temperature: -55°C ~ 155°C; Packaging: Cut Tape (CT); Supplier Unit Price 1: 0.1; Supplier Unit Price 100: 0.0041; Supplier 1: DiGiKey; Supplier Part Number 1: 1292-WR04X470JTLCT-ND; Supplier 2: JLCPCB; Supplier Part Number 2: C170414; Supplier 3: Kosmodrom; Supplier Part Number 3: 00-00033711; Type: SMD
R19 R25 R26 R32 = Res_73: RES 100K OHM 1% 1/16W 0402; Manufacturer: YAGEO; Part Number: RES 0402 100K 1%; Manufacturer Part Number: RC0402FR-07100KL; Item: Res_73; Date Of Revision: 22-Nov-24; Operating Temperature: -55°C ~ 155°C; Packaging: Cut Tape (CT); Supplier Unit Price 1: 0.1; Supplier Unit Price 100: 0.0051; Supplier 1: DiGiKey; Supplier Part Number 1: 311-100KLRCT-ND; Supplier 2: JLCPCB; Supplier Part Number 2: C60490; Supplier 3: IMRAD; Supplier Part Number 3: 181343; Type: SMD
R20 = Res_7: RES 0 OHM JUMPER 1/10W 0603; Manufacturer: YAGEO; Part Number: RES 0603 0R; Manufacturer Part Number: RC0603JR-070RL; Item: Res_7; Date Of Revision: 17-Apr-24; Operating Temperature: -55°C ~ 155°C; Packaging: Cut Tape (CT); Supplier Unit Price 1: 0.1; Supplier Unit Price 100: 0.006; Supplier 1: DiGiKey; Supplier Part Number 1: 311-0.0GRCT-ND; Supplier 2: JLCPCB; Supplier Part Number 2: C95177; Supplier 3: Kosmodrom; Supplier Part Number 3: 00-00033814; Type: SMD
R23 R39 = Res_101: RES 470K OHM 1% 1/16W 0402; Manufacturer: Walsin Technology Corporation; Part Number: RES 0402 470K 1%; Manufacturer Part Number: WR04X4703FTL; Item: Res_101; Date Of Revision: 14-Jan-25; Operating Temperature: -55°C ~ 155°C; Packaging: Cut Tape (CT); Supplier Unit Price 1: 0.1; Supplier Unit Price 100: 0.0041; Supplier 1: DiGiKey; Supplier Part Number 1: 1292-WR04X4703FTLCT-ND; Supplier 2: JLCPCB; Supplier Part Number 2: C168230; Supplier 3: IMRAD; Supplier Part Number 3: 415065; Type: SMD
R27-R30 R46 = Res_64: RES 4.7K OHM 1% 1/16W 0402; Manufacturer: Walsin Technology Corporation; Part Number: RES 0402 4K7 1%; Manufacturer Part Number: WR04X4701FTL; Item: Res_64; Date Of Revision: 17-Jan-25; Operating Temperature: -55°C ~ 155°C; Packaging: Cut Tape (CT); Supplier Unit Price 1: 0.1; Supplier Unit Price 100: 0.004; Supplier 1: DiGiKey; Supplier Part Number 1: 1292-WR04X4701FTLCT-ND; Supplier 2: JLCPCB; Supplier Part Number 2: C163826; Supplier 3: IMRAD; Supplier Part Number 3: 463025; Type: SMD
R31 = Res_81: RES 453K OHM 1% 1/16W 0402; Manufacturer: YAGEO; Part Number: RES 0402 453K 1%; Manufacturer Part Number: RC0402FR-07453KL; Item: Res_81; Date Of Revision: 22-Nov-24; Operating Temperature: -55°C ~ 155°C; Packaging: Cut Tape (CT); Supplier Unit Price 1: 0.1; Supplier Unit Price 100: 0.0051; Supplier 1: DiGiKey; Supplier Part Number 1: YAG3164CT-ND; Supplier 2: JLCPCB; Supplier Part Number 2: C137978; Supplier 3: IMRAD; Supplier Part Number 3: 416063; Type: SMD
R36 = Res_33: RES 330 OHM 5% 1/16W 0402; Manufacturer: Walsin Technology Corporation; Part Number: RES 0402 330R 5%; Manufacturer Part Number: WR04X331 JTL; Item: Res_33; Date Of Revision: 22-Nov-24; Operating Temperature: -55°C ~ 155°C; Packaging: Cut Tape (CT); Supplier Unit Price 1: 0.1; Supplier Unit Price 100: 0.0041; Supplier 1: DiGiKey; Supplier Part Number 1: 1292-WR04X331JTLCT-ND; Supplier 2: JLCPCB; Supplier Part Number 2: C168264; Supplier 3: Kosmodrom; Supplier Part Number 3: 00-00033727; Type: SMD
R37 = Res_40: RES 1K OHM 1% 1/16W 0402; Manufacturer: Walsin Technology Corporation; Part Number: RES 0402 1K 1%; Manufacturer Part Number: WR04X1001FTL; Item: Res_40; Date Of Revision: 22-Nov-24; Operating Temperature: -55°C ~ 155°C; Packaging: Cut Tape (CT); Supplier Unit Price 1: 0.1; Supplier Unit Price 100: 0.0041; Supplier 1: DiGiKey; Supplier Part Number 1: 1292-WR04X1001FTLCT-ND; Supplier 2: JLCPCB; Supplier Part Number 2: C163815; Supplier 3: IMRAD; Supplier Part Number 3: 415145; Type: SMD
R38 = Res_24: RES 100 OHM 1% 1/16W 0402; Manufacturer: Walsin Technology Corporation; Part Number: RES 0402 100R 1%; Manufacturer Part Number: WR04X1000FTL; Item: Res_24; Date Of Revision: 05-Dec-24; Operating Temperature: -55°C ~ 155°C; Packaging: Cut Tape (CT); Supplier Unit Price 1: 0.1; Supplier Unit Price 100: 0.004; Supplier 1: DiGiKey; Supplier Part Number 1: 1292-WR04X1000FTLCT-ND; Supplier 2: JLCPCB; Supplier Part Number 2: C163808; Supplier 3: IMRAD; Supplier Part Number 3: 462996; Type: SMD
R40-R45 = Res_67: RES 10K OHM 1% 1/16W 0402; Manufacturer: YAGEO; Part Number: RES 0402 10K 1%; Manufacturer Part Number: RC0402FR-0710KL; Item: Res_67; Date Of Revision: 22-Nov-24; Operating Temperature: -55°C ~ 155°C; Packaging: Cut Tape (CT); Supplier Unit Price 1: 0.1; Supplier Unit Price 100: 0.0051; Supplier 1: DiGiKey; Supplier Part Number 1: 311-10.0KLRCT-ND; Supplier 2: JLCPCB; Supplier Part Number 2: C60490; Supplier 3: Kosmodrom; Supplier Part Number 3: 00-00071557; Type: SMD
SIM1 = Conn_47: CONN SIM CARD HINGED TYPE R/A; Manufacturer: Amphenol ICC (FCI); Part Number: SIM Card Holder; Value: 7111S2015X02LF; Item: Conn_47; Date Of Revision: 17-Jan-25; Manufacturer Part Number: 7111S2015X02LF; Operating Temperature: -40°C ~ 85°C; Packaging: Cut Tape (CT); Supplier Unit Price 1: 1.15; Supplier Unit Price 100: 0.7633; Supplier 1: DiGiKey; Supplier Part Number 1: 609-1401-1-ND; Supplier 2: JLCPCB; Supplier Part Number 2: C598923; Supplier 3: IMRAD; Supplier Part Number 3: 443681; Type: SMD
SW1 = SW_8: Without 50mA 4mm 100MΩ 100000 Times 12V 160gf 3mm 2mm Round Button Standing paste SPST SMD Tactile Switches ROHS; Manufacturer: XUNPU; Part Number: TACT SWITCH SMD 2.9x4mm; Manufacturer Part Number: TS-1088-AR02016; Item: SW_8; Date Of Revision: 26-Nov-24; Operating Temperature: -30°C ~ 80°C; Supplier 1: DiGiKey; Supplier 2: JLCPCB; Supplier Part Number 2: C720477; Supplier 3: Kosmodrom; Supplier Part Number 3: 00-; Type: SMD
U1 = Chip_8: 4V~6V Li-Ion/Polymer 1 1A ESOP-8 Battery Management; Manufacturer: TPOWER; Item: Chip_8; Date Of Revision: 02-Aug-24; Part Number: TP4056; Manufacturer Part Number: TP4056; Operating Temperature: -40°C ~ 85°C; Supplier 1: DiGiKey; Supplier 2: JLCPCB; Supplier Part Number 2: C382139; Supplier 3: Kosmodrom; Supplier Part Number 3: 00-00061459; Type: SMD
U2 = Chip_39: SOP-8  USB2.0 Converter ROHS; Manufacturer: WCH(Jiangsu Qin Heng); Part Number: USB - UART Converter; Item: Chip_39; Date Of Revision: 21-Nov-24; Manufacturer Part Number: CH340N; Operating Temperature: -20°C ~ 70°C; Packaging: Cut Tape (CT); Supplier 1: DiGiKey; Supplier 2: JLCPCB; Supplier Part Number 2: C2977777; Supplier 3: Kosmodrom; Supplier Part Number 3: 00-00064880; Type: SMD
U3 = Chip_32: Step-down type 2A 2.7V~5.5V SOT-23-5 DC-DC Converters ROHS; Manufacturer: Silergy Corp; Part Number: Step-Down DC-DC Controller; Manufacturer Part Number: SY8089AAAC; Item: Chip_32; Date Of Revision: 17-Nov-24; Operating Temperature: -40°C ~ 85°C; Supplier 1: DiGiKey; Supplier 2: JLCPCB; Supplier Part Number 2: C78988; Supplier 3: Kosmodrom; Supplier Part Number 3: 00-; Type: SMD
U4 = Chip_12: SOT-23-6 Battery Management ROHS; Manufacturer: Slkor(SLKORMICRO Elec.); Item: Chip_12; Date Of Revision: 05-Dec-24; Part Number: DW01A; Manufacturer Part Number: DW01A; Operating Temperature: -40°C ~ 85°C; Supplier 1: DiGiKey; Supplier 2: JLCPCB; Supplier Part Number 2: C42380662; Supplier 3: IMRAD; Supplier Part Number 3: 419926; Type: SMD
VD1 VD2 = Diode_17: DIODE SCHOTTKY 30V 1A SOD123; Manufacturer: Nexperia USA Inc.; Part Number: D_SHOTTKY 30V 1A SOD-123; Manufacturer Part Number: PMEG3010EGWX; Type: SMD; Item: Diode_17; Date Of Revision: 17-Jan-25; Operating Temperature: max ~ 150°C; Packaging: Cut Tape (CT); Supplier Unit Price 1: 0.17; Supplier Unit Price 100: 0.0737; Supplier 1: DiGiKey; Supplier Part Number 1: 1727-7343-1-ND; Supplier 2: JLCPCB; Supplier Part Number 2: C503429; Supplier 3: Kosmodrom; Supplier Part Number 3: 00-
VT1 = Tr_7: 20V 3A 23mΩ@4.5V,3A 800mW 750mV@250uA 1PCSNChannel+1PCSPChannel SOT-23-6  MOSFETs ROHS; Manufacturer: ALLPOWER(ShenZhen Quan Li Semiconductor); Part Number: 2 MOSFET P-CH & N-CH 20V 3A; Item: Tr_7; Type: SMD; Date Of Revision: 17-Nov-24; Manufacturer Part Number: AP2003; Operating Temperature: -55°C ~ 150°C; Supplier 1: DiGiKey; Supplier 2: JLCPCB; Supplier Part Number 2: C2849575; Supplier 3: Kosmodrom; Supplier Part Number 3: 00-
VT2 = Tr_2: TRANS NPN 45V 0.1A SOT23-3; Manufacturer: Onsemi; Part Number: BC847BLT1G; Item: Tr_2; Type: SMD; Date Of Revision: 17-Apr-24; Manufacturer Part Number: BC847BLT1G; Operating Temperature: -55°C ~ 150°C; Packaging: Cut Tape (CT); Supplier Unit Price 1: 0.12; Supplier Unit Price 100: 0.045; Supplier 1: DiGiKey; Supplier Part Number 1: BC847BLT1GOSCT-ND; Supplier 2: JLCPCB; Supplier Part Number 2: C94393; Supplier 3: Kosmodrom; Supplier Part Number 3: 00-00031372
VT3 = Tr_9: 20V 2A 130mΩ@4.5V,2A 750mW 950mV@250uA 1 Piece P-Channel SOT-23 MOSFETs ROHS; Manufacturer: ALLPOWER(ShenZhen Quan Li Semiconductor); Part Number: MOSFET P-CH 20V 3A SOT23-3; Item: Tr_9; Type: SMD; Date Of Revision: 17-Nov-24; Manufacturer Part Number: AP2301B; Operating Temperature: -55°C ~ 150°C; Supplier 1: DiGiKey; Supplier 2: JLCPCB; Supplier Part Number 2: C2763847; Supplier 3: Kosmodrom; Supplier Part Number 3: 00-
X1 = Conn_40: CONN PCI EXP MIN FML 52POS 0.031; Manufacturer: TE Connectivity AMP Connectors; Part Number: PCI EXP MIN FML Connector; Item: Conn_40; Date Of Revision: 15-Nov-24; Manufacturer Part Number: 1775838-2; Operating Temperature: -55°C ~ 85°C; Packaging: Cut Tape (CT); Supplier Unit Price 1: 1.36; Supplier Unit Price 100: 0.8244; Supplier 1: DiGiKey; Supplier Part Number 1: A123340CT-ND; Supplier 2: JLCPCB; Supplier Part Number 2: C91936; Supplier 3: IMRAD; Supplier Part Number 3: 263473; Type: SMD
X2 = Chip_3: 20dBm MT7688AN Chip WiFi Modules; Manufacturer: HI-LINK; Item: Chip_3; Date Of Revision: 16-Nov-24; Part Number: MT7688AN Chip WiFi Modules; Manufacturer Part Number: HLK-7688A; Operating Temperature: -20°C ~ 60°C; Supplier 1: DiGiKey; Supplier 2: JLCPCB; Supplier Part Number 2: C209919; Supplier 3: Kosmodrom; Supplier Part Number 3: 00-; Type: SMD